# EAGLE design Micromouse-v21 (EAGLE 5.05)
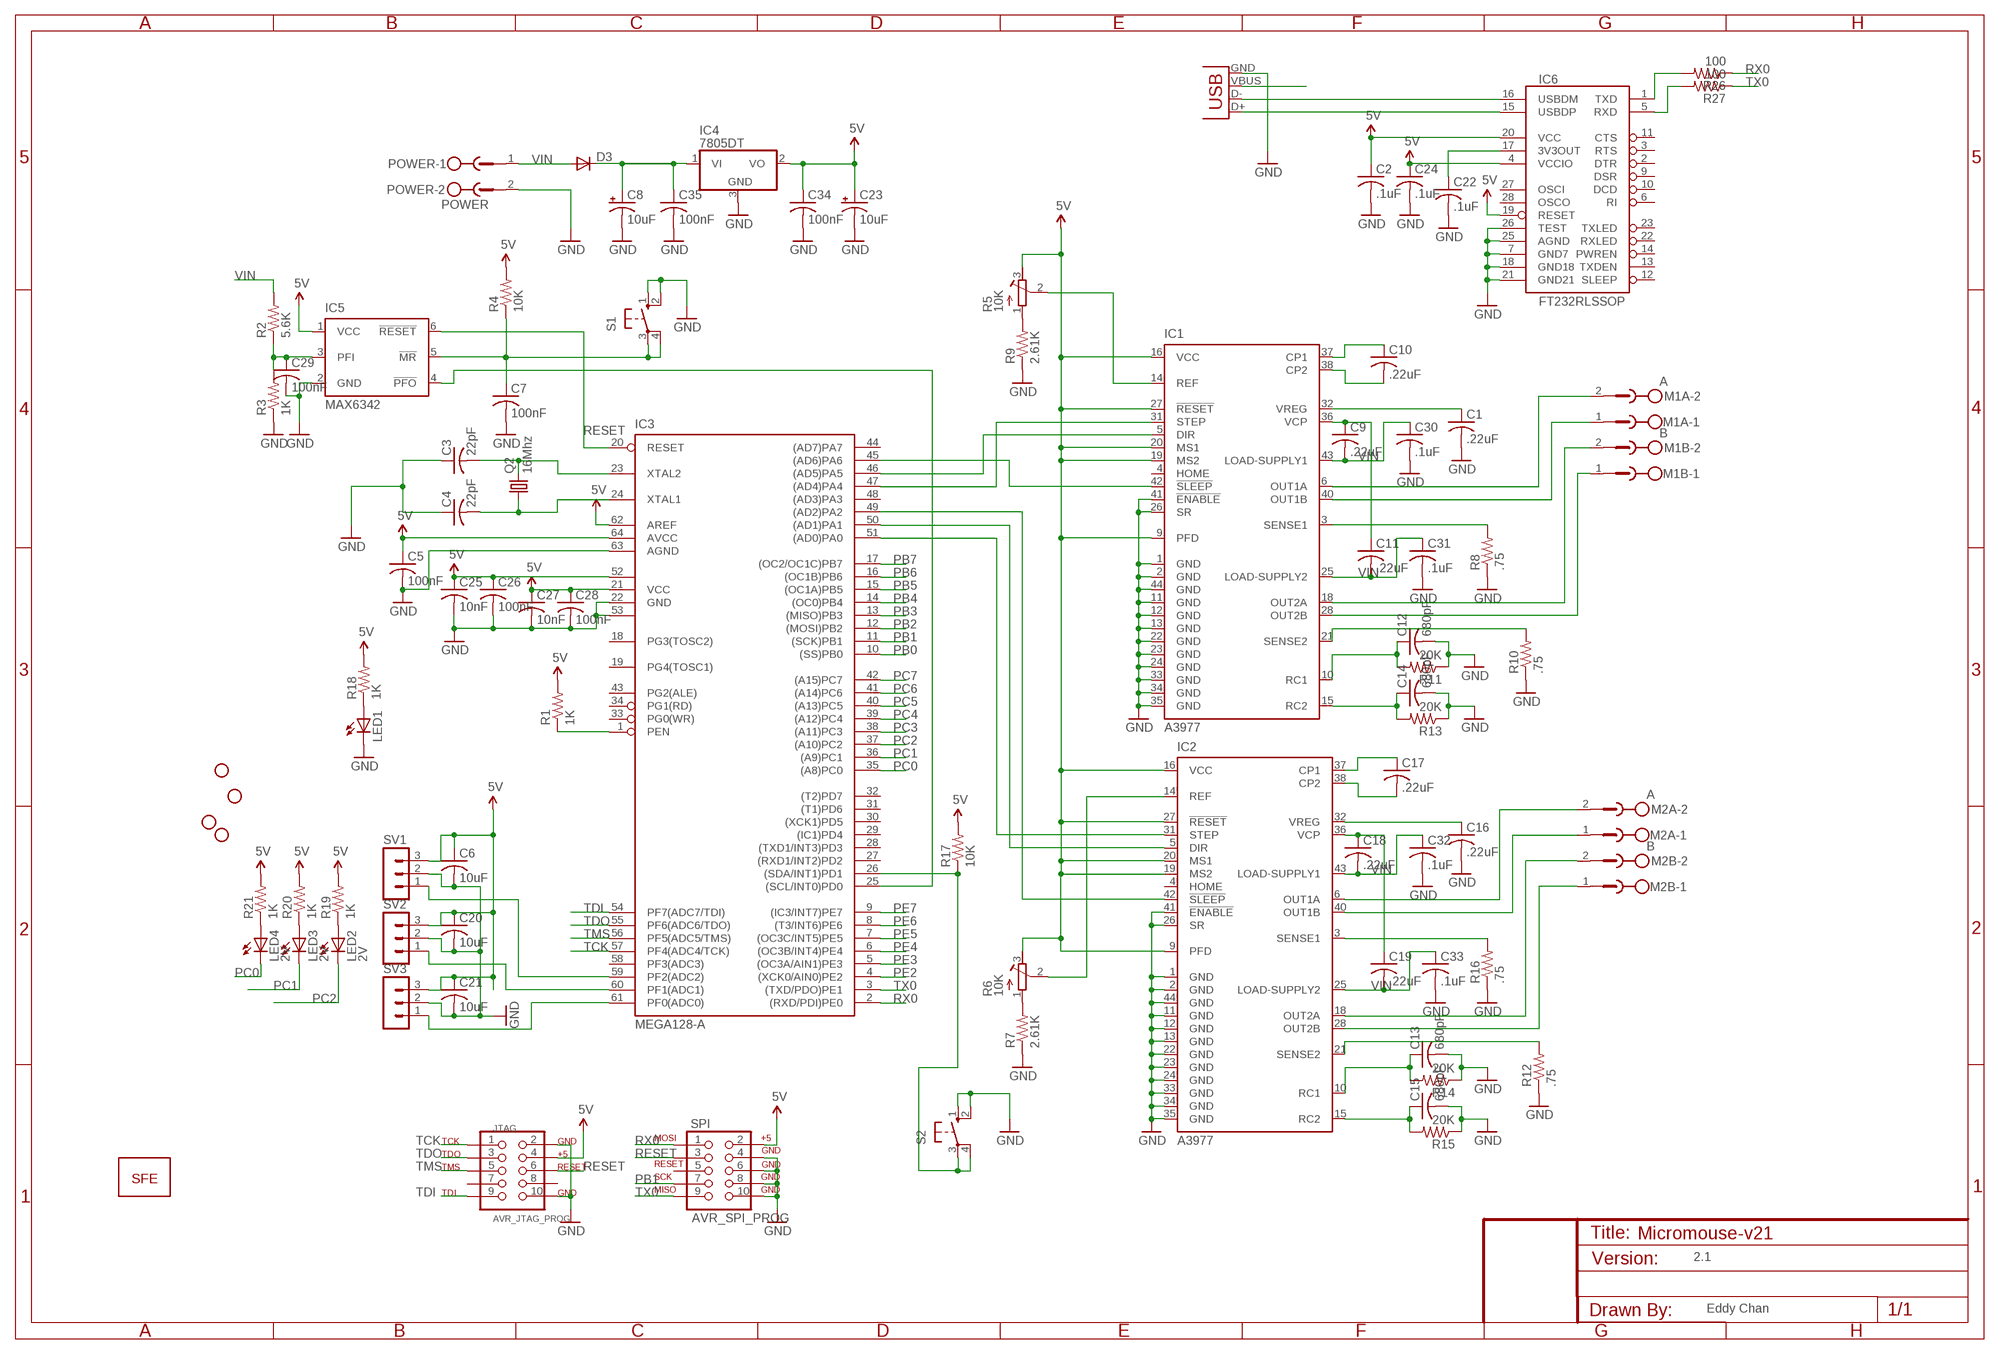
[diagram p0: schematic, sheet 1]

## Parts
C1  .22uF  C-USC0805  [C0805]
C2  .1uF  C-USC0805  [C0805]
C3  22pF  C-USC0805  [C0805]
C4  22pF  C-USC0805  [C0805]
C5  100nF  C-USC0805  [C0805]
C6  10uF  C-USC1206  [C1206]
C7  100nF  C-USC0805  [C0805]
C8  10uF  CAP_POLE  [PANASONIC_E]
C9  .22uF  C-USC0805  [C0805]
C10  .22uF  C-USC0805  [C0805]
C11  .22uF  C-USC0805  [C0805]
C12  680pF  C-USC0805  [C0805]
C13  680pF  C-USC0805  [C0805]
C14  680pF  C-USC0805  [C0805]
C15  680pF  C-USC0805  [C0805]
C16  .22uF  C-USC0805  [C0805]
C17  .22uF  C-USC0805  [C0805]
C18  .22uF  C-USC0805  [C0805]
C19  .22uF  C-USC0805  [C0805]
C20  10uF  C-USC1206  [C1206]
C21  10uF  C-USC1206  [C1206]
C22  .1uF  C-USC0805  [C0805]
C23  10uF  CAP_POLE  [PANASONIC_E]
C24  .1uF  C-USC0805  [C0805]
C25  10nF  C-USC0805  [C0805]
C26  100nF  C-USC0805  [C0805]
C27  10nF  C-USC0805  [C0805]
C28  100nF  C-USC0805  [C0805]
C29  100nF  C-USC0805  [C0805]
C30  .1uF  C-USC0805  [C0805]
C31  .1uF  C-USC0805  [C0805]
C32  .1uF  C-USC0805  [C0805]
C33  .1uF  C-USC0805  [C0805]
C34  100nF  C-USC0805  [C0805]
C35  100nF  C-USC0805  [C0805]
D3  DIODESMB  [SMB-DIODE]
IC1  A3977  [PLCC44]
IC2  A3977  [PLCC44]
IC3  MEGA128-A  [TQFP64]
IC4  7805DT  [TO252]
IC5  MAX6342  [SOT23-6L]
IC6  FT232RLSSOP  [SSOP28DB]
JTAG  AVR_JTAG_PROG  [AVR_ICSP]
LED1  LEDCHIP-LED0805  [CHIP-LED0805]
LED2  2V  LEDCHIP-LED0805  [CHIP-LED0805]
LED3  2V  LEDCHIP-LED0805  [CHIP-LED0805]
LED4  2V  LEDCHIP-LED0805  [CHIP-LED0805]
M1A  A  MSTBV2  [MSTBV2]
M1B  B  MSTBV2  [MSTBV2]
M2A  A  MSTBV2  [MSTBV2]
M2B  B  MSTBV2  [MSTBV2]
POWER  POWER  MSTBV2  [MSTBV2]
Q2  16Mhz  CRYSTALHC49US  [HC49US]
R1  1K  RESISTOR  [0805]
R2  5.6K  RESISTOR  [0805]
R3  1K  RESISTOR  [0805]
R4  10K  RESISTOR  [0805]
R5  10K  R-TRIMM3103  [RTRIM3103]
R6  10K  R-TRIMM3103  [RTRIM3103]
R7  2.61K  RESISTOR  [0805]
R8  .75  RESISTOR  [0805]
R9  2.61K  RESISTOR  [0805]
R10  .75  RESISTOR  [0805]
R11  20K  RESISTOR  [0805]
R12  .75  RESISTOR  [0805]
R13  20K  RESISTOR  [0805]
R14  20K  RESISTOR  [0805]
R15  20K  RESISTOR  [0805]
R16  .75  RESISTOR  [0805]
R17  10K  RESISTOR  [0805]
R18  1K  RESISTOR  [0805]
R19  1K  RESISTOR  [0805]
R20  1K  RESISTOR  [0805]
R21  1K  RESISTOR  [0805]
R26  100  RESISTOR  [0805]
R27  100  RESISTOR  [0805]
S1  10-XX  [B3F-10XX]
S2  10-XX  [B3F-10XX]
SPI  AVR_SPI_PROG  [AVR_ICSP]
SV1  MA03-1  [MA03-1]
SV2  MA03-1  [MA03-1]
SV3  MA03-1  [MA03-1]
U$19  STAND-OFF  [STAND-OFF]
U$20  STAND-OFF  [STAND-OFF]
U$21  STAND-OFF  [STAND-OFF]
U$22  STAND-OFF  [STAND-OFF]
U$23  LOGO-SFESK  [SFE-LOGO-FLAME]
X1  USBSMD  [USB-MINIB]

## Nets
5V: C2.1 C5.1 C6.1 C20.1 C21.1 C23.+ C24.1 C25.1 C26.1 C27.1 C28.1 C34.1 IC1.9(PFD) IC1.16(VCC) IC1.19(MS2) IC1.20(MS1) IC1.27(!RESET) IC2.9(PFD) IC2.16(VCC) IC2.19(MS2) IC2.20(MS1) IC2.27(!RESET) IC3.21(VCC) IC3.52(VCC1) IC3.62(AREF) IC3.64(AVCC) IC4.2(VO) IC5.1(VCC) IC6.4(VCCIO) IC6.19(RESET) IC6.20(VCC) JTAG.4 R1.2 R4.2 R5.3(A) R6.3(A) R17.2 R18.2 R19.2 R20.2 R21.2 SPI.2 SV1.3 SV2.3 SV3.3
GND: C1.2 C2.2 C3.1 C4.1 C5.2 C6.2 C7.2 C8.- C12.2 C13.2 C14.2 C15.2 C16.2 C20.2 C21.2 C22.2 C23.- C24.2 C25.2 C26.2 C27.2 C28.2 C29.2 C30.2 C31.2 C32.2 C33.2 C34.2 C35.2 IC1.1(GND) IC1.2(GND) IC1.11(GND) IC1.12(GND) IC1.13(GND) IC1.22(GND) IC1.23(GND) IC1.24(GND) IC1.26(SR) IC1.33(GND) IC1.34(GND) IC1.35(GND) IC1.41(!ENABLE) IC1.44(GND) IC2.1(GND) IC2.2(GND) IC2.11(GND) IC2.12(GND) IC2.13(GND) IC2.22(GND) IC2.23(GND) IC2.24(GND) IC2.26(SR) IC2.33(GND) IC2.34(GND) IC2.35(GND) IC2.41(!ENABLE) IC2.44(GND) IC3.22(GND) IC3.53(GND1) IC3.63(AGND) IC4.3(GND) IC5.2(GND) IC6.7(GND7) IC6.18(GND18) IC6.21(GND21) IC6.25(AGND) IC6.26(TEST) JTAG.2 JTAG.10 LED1.C POWER.2 R3.1 R7.1 R8.1 R9.1 R10.1 R11.1 R12.1 R13.1 R14.1 R15.1 R16.1 S1.1(S) S1.2(S1) S2.1(S) S2.2(S1) SPI.4 SPI.6 SPI.8 SPI.10 SV1.2 SV2.2 SV3.2 X1.GND
N$1: IC1.5(DIR) IC3.46((AD5)PA5)
N$2: IC1.31(STEP) IC3.47((AD4)PA4)
N$3: IC2.31(STEP) IC3.51((AD0)PA0)
N$4: IC2.5(DIR) IC3.50((AD1)PA1)
N$5: C8.+ C35.1 D3.C IC4.1(VI)
N$6: IC3.1(PEN) R1.1
N$7: C29.1 IC5.3(PFI) R2.1 R3.2
N$8: C3.2 IC3.23(XTAL2) Q2.2
N$9: C4.2 IC3.24(XTAL1) Q2.1
N$10: IC1.42(!SLEEP) IC3.45((AD6)PA6)
N$11: C7.1 IC5.5(!MR) R4.1 S1.3(P) S1.4(P1)
N$12: LED1.A R18.1
N$13: IC2.42(!SLEEP) IC3.49((AD2)PA2)
N$14: IC3.25((SCL/INT0)PD0) IC5.4(!PFO)
N$15: R5.1(E) R9.2
N$16: IC1.14(REF) R5.2(S)
N$17: R6.1(E) R7.2
N$18: IC2.14(REF) R6.2(S)
N$19: IC1.3(SENSE1) R8.2
N$20: IC1.21(SENSE2) R10.2
N$21: C1.1 IC1.32(VREG)
N$22: C10.1 IC1.37(CP1)
N$23: C10.2 IC1.38(CP2)
N$24: C9.1 C11.1 IC1.36(VCP)
N$25: IC2.21(SENSE2) R12.2
N$26: C12.1 IC1.10(RC1) R11.2
N$27: C14.1 IC1.15(RC2) R13.2
N$28: C13.1 IC2.10(RC1) R14.2
N$29: C15.1 IC2.15(RC2) R15.2
N$30: IC2.3(SENSE1) R16.2
N$31: C16.1 IC2.32(VREG)
N$32: C17.1 IC2.37(CP1)
N$33: C17.2 IC2.38(CP2)
N$34: C18.1 C19.1 IC2.36(VCP)
N$35: IC1.6(OUT1A) M1A.2
N$36: IC1.40(OUT1B) M1A.1
N$37: IC1.18(OUT2A) M1B.2
N$38: IC1.28(OUT2B) M1B.1
N$39: IC2.6(OUT1A) M2A.2
N$40: IC2.40(OUT1B) M2A.1
N$41: IC2.18(OUT2A) M2B.2
N$42: IC2.28(OUT2B) M2B.1
N$43: IC3.61(PF0(ADC0)) SV3.1
N$44: IC3.60(PF1(ADC1)) SV2.1
N$45: IC3.59(PF2(ADC2)) SV1.1
N$46: IC3.26((SDA/INT1)PD1) R17.1 S2.3(P) S2.4(P1)
N$47: LED2.A R19.1
N$48: LED3.A R20.1
N$49: LED4.A R21.1
N$50: X1.VBUS
N$52: IC6.16(USBDM) X1.D-
N$53: IC6.15(USBDP) X1.D+
N$54: C22.1 IC6.17(3V3OUT)
N$59: IC6.1(TXD) R26.2
N$60: IC6.5(RXD) R27.2
PB0: IC3.10((SS)PB0)
PB1: IC3.11((SCK)PB1) SPI.7
PB2: IC3.12((MOSI)PB2)
PB3: IC3.13((MISO)PB3)
PB4: IC3.14((OC0)PB4)
PB5: IC3.15((OC1A)PB5)
PB6: IC3.16((OC1B)PB6)
PB7: IC3.17((OC2/OC1C)PB7)
PC0: IC3.35((A8)PC0) LED4.C
PC1: IC3.36((A9)PC1) LED3.C
PC2: IC3.37((A10)PC2) LED2.C
PC3: IC3.38((A11)PC3)
PC4: IC3.39((A12)PC4)
PC5: IC3.40((A13)PC5)
PC6: IC3.41((A14)PC6)
PC7: IC3.42((A15)PC7)
PE2: IC3.4((XCK0/AIN0)PE2)
PE3: IC3.5((OC3A/AIN1)PE3)
PE4: IC3.6((OC3B/INT4)PE4)
PE5: IC3.7((OC3C/INT5)PE5)
PE6: IC3.8((T3/INT6)PE6)
PE7: IC3.9((IC3/INT7)PE7)
RESET: IC3.20(RESET) IC5.6(!RESET) JTAG.6 SPI.3
RX0: IC3.2((RXD/PDI)PE0) R26.1 SPI.1
TCK: IC3.57(PF4(ADC4/TCK)) JTAG.1
TDI: IC3.54(PF7(ADC7/TDI)) JTAG.9
TDO: IC3.55(PF6(ADC6/TDO)) JTAG.3
TMS: IC3.56(PF5(ADC5/TMS)) JTAG.5
TX0: IC3.3((TXD/PDO)PE1) R27.1 SPI.9
VIN: C9.2 C11.2 C18.2 C19.2 C30.1 C31.1 C32.1 C33.1 D3.A IC1.25(LOAD-SUPPLY2) IC1.43(LOAD-SUPPLY1) IC2.25(LOAD-SUPPLY2) IC2.43(LOAD-SUPPLY1) POWER.1 R2.2
Unconnected: IC1.4(HOME) IC2.4(HOME) IC3.18(PG3(TOSC2)) IC3.19(PG4(TOSC1)) IC3.27((RXD1/INT2)PD2) IC3.28((TXD1/INT3)PD3) IC3.29((IC1)PD4) IC3.30((XCK1)PD5) IC3.31((T1)PD6) IC3.32((T2)PD7) IC3.33(PG0(WR)) IC3.34(PG1(RD)) IC3.43(PG2(ALE)) IC3.44((AD7)PA7) IC3.48((AD3)PA3) IC3.58(PF3(ADC3)) IC6.2(DTR) IC6.3(RTS) IC6.6(RI) IC6.9(DSR) IC6.10(DCD) IC6.11(CTS) IC6.12(SLEEP) IC6.13(TXDEN) IC6.14(PWREN) IC6.22(RXLED) IC6.23(TXLED) IC6.27(OSCI) IC6.28(OSCO) JTAG.7 JTAG.8 SPI.5

## Notes on the sheet
- 2.1
- Eddy Chan

## Library data of the parts
C1-C7 C9-C22 C24-C35 = rcl:C-US: CAPACITOR, American symbol
C8 C23 = SparkFun:CAP_POL: Capacitor Polarized These are standard SMD and PTH capacitors. Normally 10uF, 47uF, and 100uF in electrolytic and tantalum varieties. Always verify the external diameter of the through hole cap, it varies with capacity, voltage, and manufacturer. The EIA devices should be standard.
D3 = SparkFun:DIODE: Diode These are standard reverse protection diodes and small signal diodes. SMA package can handle up to about 1A. SOD-323 can handle about 200mA. What the SOD-323 package when ordering, there are some mfgs out there that are 5-pin packages.
IC1 IC2 = allegro:A3977: MICROSTEPPING DMOS DRIVER WITH TRANSLATOR Source: 3977.pdf
IC3 = atmel:MEGA128: MICROCONTROLLER 128 Kbytes FLASH 4 Kbytes SRAM 4 Kbytes EEPROM DUAL USART 8-channel 10 bit ADC Source: avr.lbr
IC4 = linear:78*: Positive VOLTAGE REGULATOR Source: http://cache.national.com/ds/LM/LM78L05.pdf http://www.fairchildsemi.com/ds/LM/LM7805.pdf
IC5 = maxim:MAX6342: RESET CIRCUIT
IC6 = SparkFun:FT232RL: USB UART FT232RL 4th Generation USB UART (USB <-> Serial) Controller. Spark Fun Electronics SKU : COM-00650
JTAG = SparkFun:AVR_JTAG_PROG
LED1-LED4 = led:LED: LED OSRAM: - CHIPLED LG R971, LG N971, LY N971, LG Q971, LY Q971, LO R971, LY R971 LH N974, LH R974 LS Q976, LO Q976, LY Q976 LO Q996 - Hyper CHIPLED LW Q18S LB Q993, LB Q99A, LB R99A - SideLED LS A670, LO A670, LY A670, LG A670, LP A670 LB A673, LV A673, LT A673, LW A673 LH A674 LY A675 LS A676, LA A676, LO A676, LY A676, LW A676 LS A679, LY A679, LG A679 - Hyper Micro SIDELED® LS Y876, LA Y876, LO Y876, LY Y876 LT Y87S - SmartLED LW L88C, LW L88S LB L89C, LB L89S, LG L890 LS L89K, LO L89K, LY L89K LS L896, LA L896, LO L896, LY L896 - TOPLED LS T670, LO T670, LY T670, LG T670, LP T670 LSG T670, LSP T670, LSY T670, LOP T670, LYG T670 LG T671, LOG T671, LSG T671 LB T673, LV T673, LT T673, LW T673 LH T674 LS T676, LA T676, LO T676, LY T676, LB T676, LH T676, LSB T676, LW T676 LB T67C, LV T67C, LT T67C, LS T67K, LO T67K, LY T67K, LW E67C LS E67B, LA E67B, LO E67B, LY E67B, LB E67C, LV E67C, LT E67C LW T67C LS T679, LY T679, LG T679 LS T770, LO T770, LY T770, LG T770, LP T770 LB T773, LV T773, LT T773, LW T773 LH T774 LS E675, LA E675, LY E675, LS T675 LS T776, LA T776, LO T776, LY T776, LB T776 LHGB T686 LT T68C, LB T68C - Hyper Mini TOPLED® LB M676 - Mini TOPLED Santana® LG M470 LS M47K, LO M47K, LY M47K Source: http://www.osram.convergy.de LUXEON: - LUMILED® LXK2-PW12-R00, LXK2-PW12-S00, LXK2-PW14-U00, LXK2-PW14-V00 LXK2-PM12-R00, LXK2-PM12-S00, LXK2-PM14-U00 LXK2-PE12-Q00, LXK2-PE12-R00, LXK2-PE12-S00, LXK2-PE14-T00, LXK2-PE14-U00 LXK2-PB12-K00, LXK2-PB12-L00, LXK2-PB12-M00, LXK2-PB14-N00, LXK2-PB14-P00, LXK2-PB14-Q00 LXK2-PR12-L00, LXK2-PR12-M00, LXK2-PR14-Q00, LXK2-PR14-R00 LXK2-PD12-Q00, LXK2-PD12-R00, LXK2-PD12-S00 LXK2-PH12-R00, LXK2-PH12-S00 LXK2-PL12-P00, LXK2-PL12-Q00, LXK2-PL12-R00 Source: www.luxeon.com KINGBRIGHT: KA-3528ASYC Source: www.kingbright.com
M1A M1B M2A M2B POWER = con-phoenix-500:MSTBV2: PHOENIX
Q2 = SparkFun:CRYSTAL: Crystals Various standard crystals. Proven footprints. Spark Fun Electronics SKU : COM-00534
R1-R4 R7-R21 R26 R27 = SparkFun:RESISTOR: Resistor Basic schematic elements and footprints for 0603, 1206, and PTH 1/10th watt (small) resistors.
R5 R6 = rcl:R-TRIMM: Trimm resistor
S1 S2 = switch-omron:10-XX: OMRON SWITCH
SPI = SparkFun:AVR_SPI_PROG: AVR ICSP Header This is the standard AVR In Circuit Serial Programming header. Minimal, but includes pin one indicator. Works with standard Olimex programmers. Also look for the 6-pin reduced version. Spark Fun Electronics SKU: PRT-00778
SV1-SV3 = con-lstb:MA03-1: PIN HEADER
U$19-U$22 = SparkFun:STAND-OFF: Stand Off This is the mechanical footprint for a #4 phillips button head screw. Use the keepout ring to avoid running the screw head into surrounding components. SKU : PRT-00447
U$23 = SparkFun:LOGO-SFE: Spark Fun Electronics PCB Logo This is the standard Spark Fun Electronics PCB logo.
X1 = SparkFun:USB: USB Connectors USB-B-PTH is fully proven SKU : PRT-00139 USB-miniB is fully proven SKU : PRT-00587 USB-A-PCB is untested. USB-A-H is throughly reviewed, but untested. Spark Fun Electronics SKU : PRT-00437 USB-B-SMT is throughly reviewed, but untested. Needs silkscreen touching up. USB-A-S has not been used/tested USB-MB-H has not been used/tested

## Board
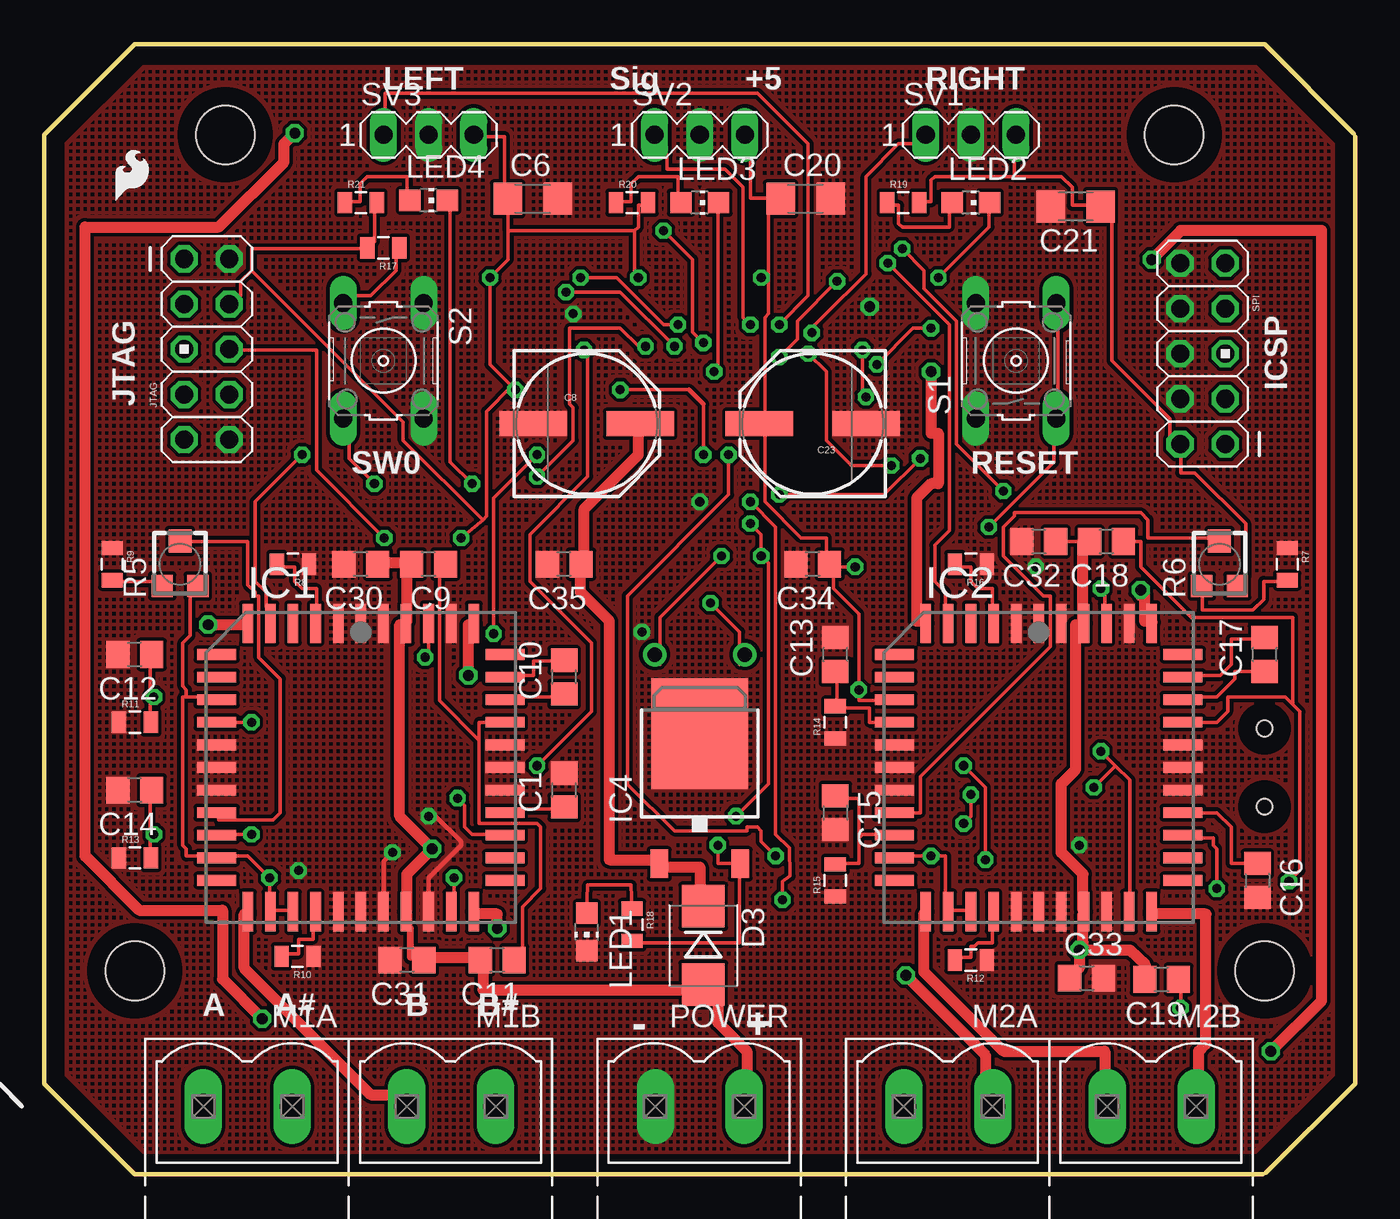
[diagram p1: board, top side]
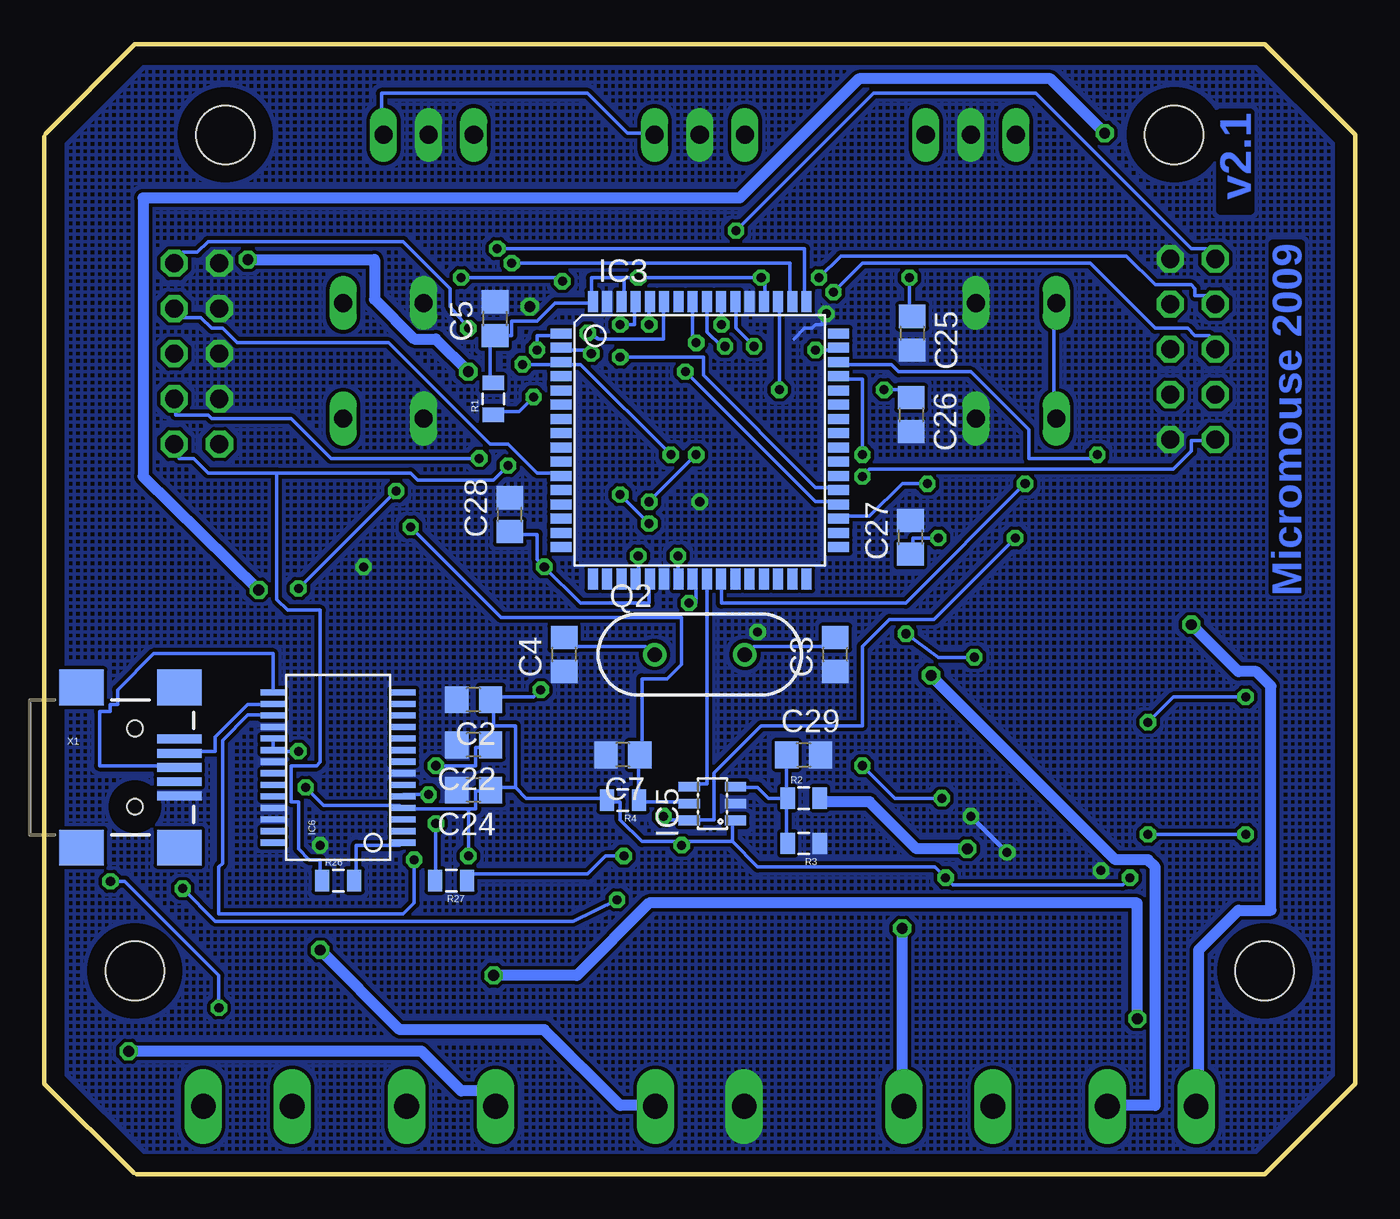
[diagram p2: board, bottom side, seen from below]

Size 73.66 x 63.5 mm. Coordinates in mm from the lower left corner, seen from the top.
Outline: 68.47,0 5.08,0 0,5.08 0,58.42 5.08,63.5 68.58,63.5 73.59,58.49
Outline: 68.65,0.07 73.66,5.08 73.66,58.31
Copper layers (1*16): Top 0.035mm / dielectric 1.5mm / Bottom 0.035mm
Design rules "default *": minimum track width 8mil, minimum drill 20mil, track to track 8mil, track to pad 8mil, pad to pad 8mil, via to via 8mil, smd to smd 8mil, copper to edge 40mil, drill to drill 8mil, minimum pad ring 10mil, minimum via ring 8mil, stop-mask expansion 4mil, vias tented up to drill 0mil, thermal gap 10mil

### Footprints (pad centres in the part's own frame; a part is rotated, then mirrored left to right if it is on the bottom)
C0805 = smd 1.3 x 1.5: 1 -0.95,0; 2 0.95,0
C1206 = smd 1.6 x 1.8: 1 -1.4,0; 2 1.4,0
PANASONIC_E = smd 3.8 x 1.4: + 3,0; - -3,0
SMB-DIODE = smd 2.4 x 2.4: A 2.2,0; C -2.2,0
PLCC44 = smd 0.6 x 2.2: 1 0,8.1; 2 -1.27,8.1; 3 -2.54,8.1; 4 -3.81,8.1; 5 -5.08,8.1; 6 -6.35,8.1; 18 -6.35,-8.1; 19 -5.08,-8.1; 20 -3.81,-8.1; 21 -2.54,-8.1; 22 -1.27,-8.1; 23 0,-8.1; 24 1.27,-8.1; 25 2.54,-8.1; 26 3.81,-8.1; 27 5.08,-8.1; 28 6.35,-8.1; 40 6.35,8.1; 41 5.08,8.1; 42 3.81,8.1; 43 2.54,8.1; 44 1.27,8.1 | smd 2.2 x 0.6: 7 -8.1,6.35; 8 -8.1,5.08; 9 -8.1,3.81; 10 -8.1,2.54; 11 -8.1,1.27; 12 -8.1,0; 13 -8.1,-1.27; 14 -8.1,-2.54; 15 -8.1,-3.81; 16 -8.1,-5.08; 17 -8.1,-6.35; 29 8.1,-6.35; 30 8.1,-5.08; 31 8.1,-3.81; 32 8.1,-2.54; 33 8.1,-1.27; 34 8.1,0; 35 8.1,1.27; 36 8.1,2.54; 37 8.1,3.81; 38 8.1,5.08; 39 8.1,6.35
TQFP64 = smd 1.194 x 0.559: 1 -7.8,6; 2 -7.8,5.2; 3 -7.8,4.4; 4 -7.8,3.6; 5 -7.8,2.8; 6 -7.8,2; 7 -7.8,1.2; 8 -7.8,0.4; 9 -7.8,-0.4; 10 -7.8,-1.2; 11 -7.8,-2; 12 -7.8,-2.8; 13 -7.8,-3.6; 14 -7.8,-4.4; 15 -7.8,-5.2; 16 -7.8,-6; 33 7.8,-6; 34 7.8,-5.2; 35 7.8,-4.4; 36 7.8,-3.6; 37 7.8,-2.8; 38 7.8,-2; 39 7.8,-1.2; 40 7.8,-0.4; 41 7.8,0.4; 42 7.8,1.2; 43 7.8,2; 44 7.8,2.8; 45 7.8,3.6; 46 7.8,4.4; 47 7.8,5.2; 48 7.8,6 | smd 0.559 x 1.194: 17 -6,-7.8; 18 -5.2,-7.8; 19 -4.4,-7.8; 20 -3.6,-7.8; 21 -2.8,-7.8; 22 -2,-7.8; 23 -1.2,-7.8; 24 -0.4,-7.8; 25 0.4,-7.8; 26 1.2,-7.8; 27 2,-7.8; 28 2.8,-7.8; 29 3.6,-7.8; 30 4.4,-7.8; 31 5.2,-7.8; 32 6,-7.8; 49 6,7.8; 50 5.2,7.8; 51 4.4,7.8; 52 3.6,7.8; 53 2.8,7.8; 54 2,7.8; 55 1.2,7.8; 56 0.4,7.8; 57 -0.4,7.8; 58 -1.2,7.8; 59 -2,7.8; 60 -2.8,7.8; 61 -3.6,7.8; 62 -4.4,7.8; 63 -5.2,7.8; 64 -6,7.8
TO252 = smd 1 x 1.6: 1 -2.28,-4.8; 2 2.28,-4.8 | smd 5.4 x 6.2: 3 0,2.5
SOT23-6L = smd 0.55 x 1.2: 1 -0.95,-1.3; 2 0,-1.3; 3 0.95,-1.3; 4 0.95,1.3; 5 0,1.3; 6 -0.95,1.3
SSOP28DB = smd 0.348 x 1.397: 1 -4.225,-3.656; 2 -3.575,-3.656; 3 -2.925,-3.656; 4 -2.275,-3.656; 5 -1.625,-3.656; 6 -0.975,-3.656; 7 -0.325,-3.656; 8 0.325,-3.656; 9 0.975,-3.656; 10 1.625,-3.656; 11 2.275,-3.656; 12 2.925,-3.656; 13 3.575,-3.656; 14 4.225,-3.656; 15 4.225,3.656; 16 3.575,3.656; 17 2.925,3.656; 18 2.275,3.656; 19 1.625,3.656; 20 0.975,3.656; 21 0.325,3.656; 22 -0.325,3.656; 23 -0.975,3.656; 24 -1.625,3.656; 25 -2.275,3.656; 26 -2.925,3.656; 27 -3.575,3.656; 28 -4.225,3.656
AVR_ICSP = drill 1.016 octagon: 1 -1.27,5.08; 2 1.27,5.08; 3 -1.27,2.54; 4 1.27,2.54; 5 -1.27,0; 6 1.27,0; 7 -1.27,-2.54; 8 1.27,-2.54; 9 -1.27,-5.08; 10 1.27,-5.08
CHIP-LED0805 = smd 1.2 x 1.2: A 0,-1.05; C 0,1.05
MSTBV2 = drill 1.397 long: 1 -2.5,0; 2 2.5,0
HC49US = drill 0.813 round: 1 -2.54,0; 2 2.54,0
0805 = smd 0.8 x 1.2: 1 -0.9,0; 2 0.9,0
RTRIM3103 = smd 1.2 x 1.25: 1 -1,-1.225; 3 1,-1.225 | smd 1.3 x 1.3: 2 0,1.3
B3F-10XX = drill 1.016 long: 1 -3.251,2.261; 2 3.251,2.261; 3 -3.251,-2.261; 4 3.251,-2.261
MA03-1 = drill 1.016 long: 1 -2.54,0; 2 0,0; 3 2.54,0
STAND-OFF = hole 3.302: 0,0
USB-MINIB = smd 2.5 x 0.5: D+ 2.5,0; D- 2.5,0.8; GND 2.5,-1.6; ID 2.5,-0.8; VBUS 2.5,1.6 | smd 2.5 x 2: GND@1 -3,-4.5; GND@2 -3,4.5; GND@3 2.5,4.5; GND@4 2.5,-4.5 | hole 0.9: 0,2.2; 0,-2.2

### Placement (x,y rotation side)
C1  29.21,21.59 90 top
C2  49.53,26.67 180 bottom
C3  29.21,29.21 90 bottom
C4  44.45,29.21 90 bottom
C5  48.33,48.08 90 bottom
C6  27.44,54.83 0 top
C7  41.15,23.57 180 bottom
C8  30.48,42.18 0 top
C9  21.59,34.29 180 top
C10  29.21,27.94 90 top
C11  25.45,12.04 180 top
C12  5.08,29.21 180 top
C13  44.45,29.21 90 top
C14  5.08,21.59 180 top
C15  44.45,20.32 270 top
C16  68.17,16.51 270 top
C17  68.58,29.21 90 top
C18  59.69,35.56 180 top
C19  62.79,10.95 180 top
C20  42.78,54.83 0 top
C21  57.96,54.39 180 top
C22  49.53,24.13 180 bottom
C23  43.18,42.18 180 top
C24  49.53,21.59 180 bottom
C25  24.89,47.27 270 bottom
C26  24.94,42.7 270 bottom
C27  24.98,35.8 90 bottom
C28  47.51,37.07 90 bottom
C29  30.99,23.57 0 bottom
C30  17.78,34.29 180 top
C31  20.37,12.04 180 top
C32  55.88,35.56 180 top
C33  58.57,11.02 0 top
C34  43.18,34.29 180 top
C35  29.21,34.29 180 top
D3  37.03,12.86 270 top
IC1  17.78,22.86 0 top
IC2  55.88,22.86 0 top
IC3  36.83,41.25 0 bottom
IC4  36.83,22.25 0 top
IC5  36.12,20.83 90 bottom
IC6  57.15,22.86 90 bottom
JTAG  9.12,46.37 0 top
LED1  30.48,13.61 180 top
LED2  52.07,54.61 270 top
LED3  36.83,54.61 270 top
LED4  21.59,54.74 270 top
M1A  11.43,3.81 180 top
M1B  22.86,3.81 180 top
M2A  50.8,3.81 180 top
M2B  62.23,3.81 180 top
POWER  36.83,3.81 180 top
Q2  36.83,29.21 0 bottom
R1  48.44,43.59 90 bottom
R2  30.99,21.13 0 bottom
R3  30.99,18.59 180 bottom
R4  41.15,21.03 180 bottom
R5  7.62,34.29 0 top
R6  66.04,34.29 0 top
R7  69.85,34.29 270 top
R8  13.97,34.29 180 top
R9  3.81,34.29 270 top
R10  14.22,12.24 180 top
R11  5.08,25.4 0 top
R12  52.07,12.04 180 top
R13  5.08,17.78 0 top
R14  44.45,25.4 90 top
R15  44.45,16.51 90 top
R16  52.07,34.29 180 top
R17  19.05,52.07 180 top
R18  33.02,14.02 270 top
R19  48.26,54.61 0 top
R20  33.02,54.61 0 top
R21  17.78,54.61 0 top
R26  57.15,16.51 0 bottom
R27  50.8,16.51 180 bottom
S1  54.61,45.72 90 top
S2  19.05,45.72 270 top
SPI  65.1,46.12 180 top
SV1  52.07,58.42 0 top
SV2  36.83,58.42 0 top
SV3  21.59,58.42 0 top
U$19  5.08,11.43 0 top
U$20  68.58,11.43 0 top
U$21  10.16,58.42 0 top
U$22  63.5,58.42 0 top
U$23  4,54.73 0 top
X1  68.58,22.86 0 bottom

### Tracks (layer width: path | path; a pad name or v marks a point on that pad's centre or on a via)
5V  (via drill 0.51)
  Top 0.203: 60.2,22.96 61.01,22.15 61.01,14.83 IC2.27 | 60.2,22.96 v59.39,23.77 | IC2.16 47.8,17.88 v49.84,17.88 50.65,17.88 50.65,14.83 IC2.19 50.85,14.83 52.07,14.83 IC2.20 | v58.98,21.74 60.2,22.96 | 7.98,26.82 7.98,27.23 7.77,27.43 7.77,29.87 8.18,30.28 8.18,32.51 8.59,32.92 R5.3 | 7.98,26.82 9.6,26.82 IC1.9 | IC1.20 13.87,14.83 12.85,14.83 IC1.19 12.65,14.83 v12.65,16.66 11.43,17.88 9.8,17.88 IC1.16 9.6,17.88 7.98,17.88 7.98,18.29 7.77,18.49 7.77,26.82 7.98,26.82 | 54.51,56.08 50.04,56.08 49.84,55.88 49.84,54.66 49.23,54.66 R19.2 | 54.51,56.08 54.51,58.32 SV1.3 | 54.51,56.08 57.15,56.08 57.76,55.47 57.76,54.46 59.18,54.46 C21.1 59.39,54.25 60,53.65 60,45.72 63.25,42.47 63.25,41.45 63.65,41.05 SPI.2 63.86,40.84 63.86,39.42 64.67,39.42 67.51,36.58 67.51,33.53 67.11,33.12 R6.3 | 40.69,54.86 39.67,54.86 39.67,58.12 SV2.3 | 40.69,54.86 41.3,54.86 C20.1 40.69,54.86 | 44.35,34.14 44.14,34.14 C34.1 | 44.35,34.14 v45.57,34.14 | 40.49,41.86 40.28,42.06 C23.+ 40.49,41.86 | 40.49,41.86 40.49,37.8 42.52,35.76 43.94,35.76 43.94,34.34 C34.1 | 40.69,50.39 40.69,48.36 40.49,48.16 40.49,41.86 | 40.69,50.39 40.69,54.86 | 40.69,50.39 v40.28,50.39 | R21.2 18.54,54.46 18.54,52.43 18.34,52.22 R17.2 18.14,52.02 11.63,52.02 11.63,50.8 | 11.63,50.8 11.02,50.19 11.02,49.38 10.41,48.77 JTAG.4 | 33.17,53.03 33.38,53.24 33.38,54.46 33.78,54.46 R20.2 | 33.17,53.03 26.06,53.03 | 26.06,53.03 26.06,54.66 C6.1 25.86,54.86 25.86,58.32 24.23,58.32 SV3.3 | 26.06,53.03 26.06,51.41 v25.04,50.39 25.04,45.52 26.26,44.3 | 24.64,36.78 24.84,36.98 24.84,42.88 26.26,44.3 | 24.64,36.78 v23.42,35.76 | 26.26,44.3 v26.47,44.09
  Top 0.203: 11.63,50.8 20.17,42.27 20.17,41.25 24.64,36.78 | v33.38,50.39 33.17,50.6 33.17,53.03 | 44.35,34.14 44.35,32.92 45.77,31.5 v45.77,27.23 45.77,26.62 47.6,26.62 IC2.9 | 44.35,34.14 C34.1 | R18.2 33.17,13.01 39.06,13.01 39.06,17.27 IC4.2 39.06,17.48 37.85,17.48 v37.85,18.49 | v23.01,16.66 23.01,14.83 IC1.27
  Bottom 0.203: v59.39,23.77 60.6,23.77 IC6.20 60.81,23.98 60.81,24.38 IC6.19 | 49.84,20.52 49.43,20.52 49.43,21.54 48.62,21.54 C24.1 48.41,21.74 47.19,21.74 | 49.84,20.52 53.49,20.52 IC6.4 53.7,20.73 57.96,20.73 v58.98,21.74 | 49.84,20.52 v49.84,17.88 | 41.1,50.39 v40.28,50.39 v33.38,50.39 33.17,50.39 33.17,49.17 IC3.52 | 41.1,50.39 41.1,49.17 IC3.62 | 41.1,50.39 42.93,50.39 42.93,49.17 IC3.64 42.93,48.97 44.96,48.97 45.97,47.95 47.4,47.95 47.4,47.14 C5.1 48.41,46.94 48.62,46.94 48.62,44.5 R1.2 | IC3.21 39.67,33.33 39.67,32.11 43.54,32.11 v45.57,34.14 45.97,34.54 45.97,35.97 47.4,35.97 C28.1 | v25.04,50.39 25.04,48.36 C25.1 | v26.47,44.09 25.45,44.09 25.04,43.69 C26.1 | v23.42,35.76 24.84,35.76 24.84,34.95 C27.1 | SV1.3 54.71,58.52 54.71,60.76 43.13,60.76 40.89,58.52 39.47,58.52 SV2.3 | 47.19,21.74 47.19,25.2 48.41,25.2 48.41,26.62 C2.1 48.41,26.82 46.18,26.82 v45.77,27.23 | 47.19,21.74 46.58,21.13 42.11,21.13 R4.2 41.91,20.93 41.3,20.93 41.3,19.91 40.08,18.69 37.85,18.69 | 35,18.69 35,19.71 IC5.1 | 35,18.69 37.85,18.69 | 35,18.69 33.58,17.27 23.62,17.27 v23.01,16.66 22.61,16.26 13.06,16.26 v12.65,16.66 | 37.85,18.69 v37.85,18.49
GND  (via drill 0.51, 0.61)
  Top 0.254: IC1.24 19.05,17.58 v19.56,18.09 | v21.59,20.12 22,20.12 23.42,18.69 23.42,18.49 21.59,16.66 IC1.26
  Bottom 0.203: 31.55,46.94 30.94,47.55 30.53,47.55 30.33,47.75 29.92,47.75 29.92,47.95 29.72,47.95 v29.72,48.36
  Bottom 0.254: v19.56,18.09 v21.59,20.12
  other vias: 36.83,37.8 55.73,34.14 33.58,30.48 58.17,18.49 46.38,48.77 14.27,17.07
  pour Top (no thermals, hatched): 0.41,58.22 0.41,5.18 5.18,0.41 68.48,0.41 73.25,5.18 73.25,58.22 68.48,62.99 5.18,62.99
  pour Bottom (no thermals, hatched): 0.41,58.22 0.41,5.18 5.18,0.41 68.48,0.41 73.25,5.18 73.25,58.22 68.48,62.99 5.18,62.99
N$1  (via drill 0.51)
  Top 0.203: v14.48,40.44 11.84,37.8 11.84,33.33 12.45,32.72 12.45,31.9 12.65,31.7 12.65,31.09 IC1.5
  Bottom 0.203: v14.48,40.44 14.68,40.23 18.34,40.23 18.34,41.86 21.59,45.11 25.65,45.11 26.06,45.52 28.91,45.52 IC3.46
N$2  (via drill 0.51)
  Top 0.203: v30.33,46.33 30.53,46.13 30.53,39.22 27.28,35.97 27.28,33.33 30.73,29.87 30.73,26.01 v27.69,22.96 | v23.22,21.13 23.62,20.73 23.62,19.51 24.03,19.1 25.86,19.1 IC1.31
  Bottom 0.203: v30.33,46.33 29.11,46.33 IC3.47 | v27.69,22.96 25.86,21.13 v23.22,21.13
N$3  (via drill 0.51)
  Top 0.203: 36.22,44.09 v32.36,44.09 | v37.03,40.44 37.03,43.28 | v39.67,37.8 41.1,36.37 41.1,19.1 41.86,18.34 41.91,16.76 41.48,16.46 v41.48,15.42 | v65.89,16.05 65.89,18.29 65.68,18.49 65.68,18.9 64.06,18.9 IC2.31
  Top 0.254: 37.03,43.28 36.22,44.09
  Bottom 0.203: v32.36,44.09 32.36,48.97 IC3.51 | v39.67,37.8 v37.03,40.44 | v41.48,15.42 43.94,14.22 64.06,14.22 v65.89,16.05
N$4  (via drill 0.51)
  Top 0.203: v47.4,51.21 50.85,47.75 50.85,36.17 50.04,35.36 50.04,33.33 50.65,32.72 50.65,31.09 IC2.5
  Bottom 0.203: v47.4,51.21 31.75,51.21 31.75,49.17 IC3.50
N$5
  Top 0.61: D3.C 36.83,15.24 36.83,17.27 34.59,17.27 IC4.1 34.39,17.68 31.75,17.68 31.75,31.09 30.12,32.72 30.12,34.14 C35.1 30.33,34.34 30.33,37.39 33.38,40.44 33.38,42.06 C8.+
N$6  (via drill 0.51)
  Top 0.203: v45.97,46.33 45.97,43.69 v46.18,43.69
  Bottom 0.203: v45.97,46.33 45.97,47.14 44.76,47.14 IC3.1 | v46.18,43.69 46.99,42.88 48.41,42.88 R1.1
N$7
  Bottom 0.203: 31.95,21.13 31.95,18.69 R3.2 | 31.95,21.13 32.97,21.13 33.58,21.74 34.8,21.74 IC5.3 | 31.95,21.13 31.95,23.57 C29.1 | 31.95,21.13 R2.1
N$8  (via drill 0.51)
  Top 0.203: v38.05,34.75 34.59,31.29 34.59,28.65 Q2.2
  Bottom 0.203: v38.05,34.75 38.05,33.53 IC3.23 | C3.2 29.31,30.07 29.72,29.67 33.78,29.67 34.19,29.26 Q2.2
N$9  (via drill 0.51)
  Top 0.203: v37.44,32.11 39.06,30.48 39.06,28.65 Q2.1
  Bottom 0.203: v37.44,32.11 37.03,32.11 37.03,33.33 IC3.24 | C4.2 44.35,30.07 43.94,29.67 39.88,29.67 39.47,29.26 Q2.1
N$10  (via drill 0.51)
  Top 0.203: v27.69,40.44 25.25,38 v25.25,30.38 | v21.39,29.06 21.59,29.06 IC1.42
  Bottom 0.203: v27.69,40.44 27.69,44.7 28.91,44.7 IC3.45 | v25.25,30.38 23.42,29.06 v21.39,29.06
N$11  (via drill 0.51)
  Top 0.203: S1.4 56.95,48.97 56.95,42.47 S1.3 56.74,42.47 56.74,40.03 v53.09,36.37
  Bottom 0.203: IC5.5 37.44,20.93 40.08,20.93 R4.1 40.28,21.13 40.28,23.57 C7.1 40.08,23.57 40.08,27.84 38.66,27.84 37.85,28.65 37.85,31.29 48.01,31.29 v53.09,36.37
N$12
  Top 0.203: LED1.A 30.53,16.26 32.97,16.26 R18.1
N$13  (via drill 0.51)
  Top 0.203: v48.21,52.02 49.43,50.8 49.43,49.78 51.26,47.95 51.26,41.05 v53.9,38.41 | v59.39,32.92 59.59,32.72 59.59,31.09 IC2.42
  Bottom 0.203: v48.21,52.02 30.94,52.02 30.94,49.17 IC3.49 | v53.9,38.41 v59.39,32.92
N$14
  Bottom 0.203: IC3.25 36.42,33.33 36.42,21.95 37.24,21.95 IC5.4
N$15
  Top 0.203: R9.2 3.91,33.33 6.55,33.33 6.55,33.12 R5.1
N$16
  Top 0.203: R5.2 7.77,35.56 11.43,35.56 11.43,33.12 11.84,32.72 11.84,32.51 12.04,32.51 12.04,29.06 13.26,27.84 13.26,20.32 12.85,19.91 9.8,19.91 9.8,20.32 IC1.14
N$17
  Top 0.203: R7.2 69.75,33.33 68.53,33.33 68.53,32.31 67.92,31.7 65.08,31.7 65.08,32.92 R6.1
N$18
  Top 0.203: R6.2 65.89,35.76 62.03,35.76 62.03,36.78 61.62,37.19 54.51,37.19 54.51,36.98 53.9,36.37 53.9,34.75 56.13,32.51 56.54,32.51 56.54,29.67 49.23,22.35 49.23,20.32 IC2.14
N$19
  Top 0.203: R8.2 13.26,34.14 14.07,34.14 14.07,33.33 14.48,32.92 15.29,32.92 15.29,31.09 IC1.3
N$20
  Top 0.203: R10.2 13.46,12.39 14.27,12.39 14.27,13.21 15.09,13.21 15.09,14.63 IC1.21
N$21
  Top 0.203: C1.1 29.11,20.52 26.06,20.52 26.06,20.32 IC1.32
N$22
  Top 0.203: C10.1 29.11,26.82 26.06,26.82 IC1.37
N$23
  Top 0.203: C10.2 29.11,28.85 27.48,28.85 27.48,28.04 26.06,28.04 IC1.38
N$24
  Top 0.203: 24.44,24.38 24.44,25.4 IC1.36 | 24.44,24.38 24.44,19.71 27.69,19.71 27.89,19.51 27.89,16.05 26.87,15.04 26.87,12.6 26.47,12.19 C11.1 | 24.44,24.38 22.2,26.62 22.2,33.93 22.4,34.14 C9.1
N$25
  Top 0.203: R12.2 51.26,12.19 52.07,12.19 52.07,12.8 52.27,12.8 52.48,13.01 53.29,13.01 53.29,14.63 IC2.21
N$26  (via drill 0.51)
  Top 0.203: 5.94,26.82 5.94,29.06 C12.1 | 5.94,26.82 5.94,25.4 R11.2 | 5.94,26.82 v6.15,26.82 | v11.63,25.4 IC1.10
  Bottom 0.203: v11.63,25.4 10.21,26.82 v6.15,26.82
N$27  (via drill 0.51)
  Top 0.203: 5.94,19.1 5.94,21.54 C14.1 | 5.94,19.1 5.94,17.88 R13.2 | v11.63,19.1 9.8,19.1 IC1.15 | 5.94,19.1 v6.15,19.1
  Bottom 0.203: v6.15,19.1 v11.63,19.1
N$28
  Top 0.203: C13.1 44.55,28.25 44.55,26.42 R14.2 44.55,26.21 46.38,26.21 46.38,25.4 IC2.10
N$29
  Top 0.203: 45.77,18.9 45.77,17.48 44.55,17.48 R15.2 | 45.77,18.9 45.97,19.1 47.6,19.1 IC2.15 | 45.77,18.9 45.77,21.13 44.55,21.13 C15.1
N$30
  Top 0.203: R16.2 51.26,34.14 52.07,34.14 52.07,33.33 52.48,32.92 53.29,32.92 53.29,31.09 IC2.3
N$31
  Top 0.203: C16.1 68.12,17.48 66.7,17.48 66.7,19.51 65.89,20.32 IC2.32
N$32
  Top 0.203: C17.1 68.53,28.25 66.9,28.25 66.9,27.84 65.89,26.82 64.06,26.82 IC2.37
N$33
  Top 0.203: C17.2 68.53,30.07 66.7,30.07 66.7,28.65 66.09,28.04 64.06,28.04 IC2.38
N$34  (via drill 0.51)
  Top 0.203: v63.86,9.35 63.86,10.77 C19.1 | v69.95,16.46 70.56,17.07 70.56,26.01 70.16,26.42 | 70.16,26.42 69.75,26.82 66.5,26.82 66.5,26.01 65.89,25.4 IC2.36 | 70.16,26.42 70.16,31.29 64.47,31.29 61.62,34.14 61.62,35.56 C18.1
  Bottom 0.203: v63.86,9.35 63.86,11.18 69.14,16.46 v69.95,16.46
N$35  (via drill 0.61)
  Top 0.61: v9.2,30.89 11.43,30.89 IC1.6
  Bottom 0.61: v9.2,30.89 6.55,28.25 5.54,28.25 4.72,27.43 4.72,14.83 6.55,14.83 8.79,12.6 8.79,3.86 M1A.2
N$36  (via drill 0.61)
  Top 0.61: v23.83,28.04 23.83,30.89 24.03,30.89 IC1.40
  Bottom 0.61: v23.83,28.04 13.46,17.68 11.63,17.68 11.23,17.27 11.23,3.86 13.87,3.86 M1A.1
N$37
  Top 0.61: IC1.18 11.43,14.63 11.23,14.63 11.23,11.58 18.34,4.47 20.17,4.47 20.17,3.86 M1B.2
N$38  (via drill 0.61)
  Top 0.61: v25.45,13.82 25.45,14.63 24.23,14.63 IC1.28
  Bottom 0.61: v25.45,13.82 25.45,3.86 M1B.1
N$39  (via drill 0.61)
  Top 0.61: v49.84,45.11 49.84,41.66 50.24,41.66 50.24,38.81 49.84,38.81 49.02,38 49.02,31.09 49.43,31.09 IC2.6 | v62.23,51.41 63.86,53.03 71.78,53.03 71.78,9.75 v68.94,6.91
  Bottom 0.61: v49.84,45.11 51.66,46.94 52.88,46.94 55.12,49.17 55.12,51.41 v62.23,51.41 | v68.94,6.91 52.48,6.91 50.24,4.67 49.02,4.67 48.21,3.86 M2A.2
N$40  (via drill 0.61)
  Top 0.61: v61.62,32.84 61.62,32.51 61.82,32.51 61.82,31.09 62.23,31.09 IC2.40 | v14.07,58.52 13.46,57.91 13.46,56.9 9.8,53.24 2.29,53.24 2.29,17.88 5.33,14.83 10.01,14.83 10.01,10.97 v12.24,8.74 | v48.41,11.18 52.88,6.71 52.88,4.27 53.29,3.86 M2A.1
  Bottom 0.61: v61.62,32.84 68.12,39.22 68.12,54.86 34.59,54.86 27.89,61.57 17.12,61.57 v14.07,58.52 | v12.24,8.74 12.24,15.24 39.67,15.24 43.74,11.18 v48.41,11.18
N$41
  Top 0.61: IC2.18 49.43,14.63 49.43,11.38 53.9,6.91 59.59,6.91 59.59,3.86 M2B.2
N$42
  Top 0.61: IC2.28 62.23,14.63 65.28,14.63 65.28,7.32 64.87,6.91 64.87,3.86 M2B.1
N$43  (via drill 0.51)
  Top 0.203: v41.3,47.75 42.93,49.38 42.93,57.91 40.08,60.76 19.15,60.76 19.15,58.52 SV3.1
  Bottom 0.203: v41.3,47.75 40.49,47.75 40.49,48.97 IC3.61
N$44  (via drill 0.51)
  Top 0.203: v39.67,47.75 39.27,48.16 39.27,55.47 38.25,56.49 35,56.49 35,57.3 34.39,57.91 34.39,58.32 SV2.1
  Bottom 0.203: v39.67,47.75 39.67,48.97 IC3.60
N$45  (via drill 0.51)
  Top 0.203: v43.13,47.3 43.13,47.57 43.81,48.26 46.18,50.6 46.18,56.08 48.01,57.91 49.43,57.91 49.43,58.32 SV1.1
  Bottom 0.203: v43.13,47.3 42.52,46.94 38.86,46.94 38.86,48.97 IC3.59
N$46  (via drill 0.51)
  Top 0.203: R17.1 19.76,52.02 19.76,50.8 18.34,49.38 16.92,49.38 16.92,48.97 S2.3 | v18.54,38.81 17.12,40.23 17.12,42.27 16.92,42.47 S2.4
  Bottom 0.203: v18.54,38.81 25.25,32.11 35.61,32.11 35.61,33.33 IC3.26 | S2.3 16.92,48.97 16.92,42.47 S2.4
N$47
  Top 0.203: R19.1 47.4,54.46 48.01,54.46 48.01,53.44 48.21,53.24 50.85,53.24 50.85,54.46 LED2.A
N$48
  Top 0.203: R20.1 32.16,54.66 32.97,54.66 32.97,55.68 33.38,56.08 35.61,56.08 35.61,54.66 LED3.A
N$49
  Top 0.203: R21.1 16.92,54.66 17.73,54.66 17.73,55.68 18.14,56.08 20.37,56.08 20.37,54.86 LED4.A
N$52
  Bottom 0.203: IC6.16 60.81,26.42 62.23,26.42 64.06,24.59 64.06,23.77 65.89,23.77 X1.D-
N$53
  Bottom 0.203: IC6.15 60.81,27.23 60.81,29.26 67.51,29.26 69.55,27.23 69.55,26.42 69.95,26.42 69.95,26.01 70.56,26.01 70.56,22.96 66.09,22.96 X1.D+
N$54  (via drill 0.51)
  Top 0.203: v52.88,17.68 52.88,21.74 v51.66,22.96
  Bottom 0.203: v52.88,17.68 52.88,15.24 53.49,14.63 63.86,14.63 63.86,17.27 63.65,17.48 63.65,24.38 62.23,25.81 60.81,25.81 IC6.17 | v51.66,22.96 49.43,22.96 49.43,23.98 48.62,23.98 C22.1
N$59
  Bottom 0.203: R26.2 56.13,16.66 56.13,18.49 53.7,18.49 IC6.1
N$60  (via drill 0.51)
  Top 0.203: v51.66,19.71 52.07,20.12 v52.07,21.34
  Bottom 0.203: v51.66,19.71 51.66,16.66 R27.2 | v52.07,21.34 53.49,21.34 IC6.5
PB1
  Bottom 0.203: IC3.11 44.76,39.42 45.97,39.42 47.6,41.05 48.62,41.05 54.3,46.74 62.84,46.74 63.65,47.55 64.26,47.55 64.87,48.16 65.89,48.16 66.29,48.56 SPI.7
PC0  (via drill 0.51)
  Top 0.203: v24.03,38.81 22.81,40.03 22.81,54.66 LED4.C
  Bottom 0.203: v24.03,38.81 25.45,38.81 27.28,36.98 28.91,36.98 IC3.35
PC1  (via drill 0.51)
  Top 0.203: v37.64,45.11 37.85,45.31 37.85,54.46 LED3.C
  Bottom 0.203: v37.64,45.11 30.33,37.8 29.11,37.8 IC3.36
PC2  (via drill 0.51)
  Top 0.203: v41.3,45.92 42.32,46.94 42.32,47.95 v44.55,50.19 | v50.24,50.39 53.09,53.24 53.09,54.46 LED2.C
  Bottom 0.203: v41.3,45.92 36.63,45.92 36.63,44.91 30.33,38.61 29.11,38.61 IC3.37 | v44.55,50.19 44.76,50.39 v50.24,50.39
RESET  (via drill 0.51)
  Top 0.203: v38.86,20.12 40.69,21.95 40.69,34.34 v40.28,34.75 40.28,35.97 v39.67,36.58 | v19.1,35.76 15.29,39.57 15.29,46.33 10.41,46.33 JTAG.6 | v49.23,40.23 47.19,38.2 v41.3,38.2
  Bottom 0.203: v40.28,34.75 40.28,33.53 IC3.20 | v38.86,20.12 38.66,19.91 37.44,19.91 IC5.6 37.24,19.91 36.02,19.91 36.02,22.55 33.38,25.2 27.69,25.2 27.69,29.67 26.16,31.19 23.67,31.19 v19.1,35.76 | v49.23,40.23 57.56,40.23 59.79,42.47 64.26,42.47 64.47,42.67 66.29,42.67 66.29,43.48 SPI.3 | v39.67,36.58 v41.3,38.2
RX0  (via drill 0.51)
  Top 0.203: v42.93,46.13 43.94,45.11 43.94,41.25 45.36,39.83 v47.6,39.83
  Bottom 0.203: v42.93,46.13 42.93,46.33 44.55,46.33 IC3.2 | v47.6,39.83 48.41,39.01 52.68,39.01 53.09,39.42 60.6,39.42 | 60.6,39.42 64.47,39.42 65.28,40.23 66.09,40.23 66.09,40.84 66.29,40.84 SPI.1 | 60.6,39.42 60.6,32.31 60,31.7 58.17,31.7 58.17,23.16 58.37,22.96 59.79,22.96 59.79,20.93 59.39,20.93 59.39,18.29 58.78,17.68 58.17,17.68 58.17,16.66 R26.1
TCK  (via drill 0.51)
  Top 0.203: v37.03,46.74 36.42,47.35 36.42,51.41 v34.8,53.03
  Bottom 0.203: v37.03,46.74 37.24,46.74 37.24,48.97 IC3.57 | v34.8,53.03 27.08,60.76 17.93,60.76 9.2,52.02 8.38,52.02 7.98,51.61 JTAG.1
TDI  (via drill 0.51)
  Top 0.203: v33.78,46.53 33.38,46.53 32.36,47.55 29.52,47.55 29.52,43.28 29.72,43.08 29.72,41.25 v27.69,39.22
  Bottom 0.203: v33.78,46.53 34.8,47.55 34.8,48.97 IC3.54 | v27.69,39.22 27.28,39.62 10.21,39.62 9.2,40.64 9.2,41.25 7.98,41.25 JTAG.9
TDO  (via drill 0.51)
  Top 0.203: v35.61,47.75 34.8,47.75 32.16,50.39 v30.12,50.39
  Bottom 0.203: v35.61,47.75 35.61,48.97 IC3.55 | v30.12,50.39 28.91,51.61 12.85,51.61 11.23,49.99 9.2,49.99 8.99,49.78 8.99,49.38 8.38,49.38 7.98,48.97 JTAG.3
TMS  (via drill 0.51)
  Top 0.203: v35.41,46.53 32.36,49.58 v29.31,49.58
  Bottom 0.203: v35.41,46.53 35.61,46.53 36.42,47.35 36.42,48.97 IC3.56 | v29.31,49.58 27.69,51.21 14.88,51.21 11.23,47.55 9.4,47.55 8.99,47.14 8.18,47.14 8.18,46.53 7.98,46.53 JTAG.5
TX0  (via drill 0.51)
  Top 0.203: v46.79,45.52 48.82,47.55 v49.84,47.55 | v41.1,17.88 40.28,18.69 40.28,19.3 40.08,19.51 39.47,19.51 39.47,19.3 35.41,19.3 32.77,21.89 32.77,32.51 38.46,38.2 v38.46,40.44
  Bottom 0.203: v46.79,45.52 44.76,45.52 IC3.3 44.55,45.52 43.54,45.52 v38.46,40.44 | v49.84,47.55 50.85,48.77 50.85,49.78 53.49,52.43 64.47,52.43 65.08,51.82 65.89,51.82 66.5,51.21 SPI.9 | v41.1,17.88 42.11,17.88 43.13,16.87 49.63,16.87 49.84,16.66 R27.1
VIN  (via drill 0.61)
  Top 0.203: C32.1 58.37,35.56 C18.2 | IC2.43 58.37,31.09 | 58.17,11.58 57.76,11.18 C33.1 | 61.82,10.97 C19.2 | 18.75,34.34 C30.1 | 20.57,34.34 C9.2 20.57,34.14 | IC1.43 20.37,31.09 | 21.39,12.19 C31.1 21.18,12.19 | 20.37,14.63 IC1.25 | 58.37,14.63 IC2.25 | v58.17,12.6 58.17,12.8 58.37,13.01 v58.17,12.6
  Top 0.406: 21.18,12.19 20.57,12.19 20.57,13.82 20.37,14.02
  Top 0.61: 58.37,31.09 58.37,35.56 | 58.17,11.58 v58.17,12.6 61.01,12.6 61.87,11.79 61.87,10.97 61.82,10.97 | 20.57,34.34 18.75,34.34 | 20.57,34.14 20.37,33.93 20.37,31.09 | POWER.1 39.47,3.86 39.47,6.91 37.85,8.53 37.85,9.75 37.03,10.57 D3.A 36.83,10.36 24.64,10.36 24.64,11.79 C11.2 24.23,12.19 21.39,12.19 | IC1.25 20.37,14.83 20.37,16.87 v21.79,18.29 19.96,20.12 19.96,30.89 20.17,30.89 IC1.43 | 20.37,14.02 20.37,14.63 | 58.37,13.01 58.37,14.63 | IC2.43 58.37,30.89 57.96,30.89 57.96,22.76 57.15,21.95 57.15,18.09 58.37,16.87 58.37,14.83 IC2.25
  Bottom 0.61: v21.79,18.29 24.64,18.29 27.28,20.93 29.92,20.93 29.92,21.13 R2.2 | v58.17,12.6 53.7,8.13 45.57,8.13 41.3,3.86 39.47,3.86 POWER.1

### Text on the board
Bottom: v2.1 | Micromouse 2009
tPlace: LEFT | Sig | +5 | RIGHT | ICSP | JTAG | SW0 | RESET | A | A# | B | B# | - | +